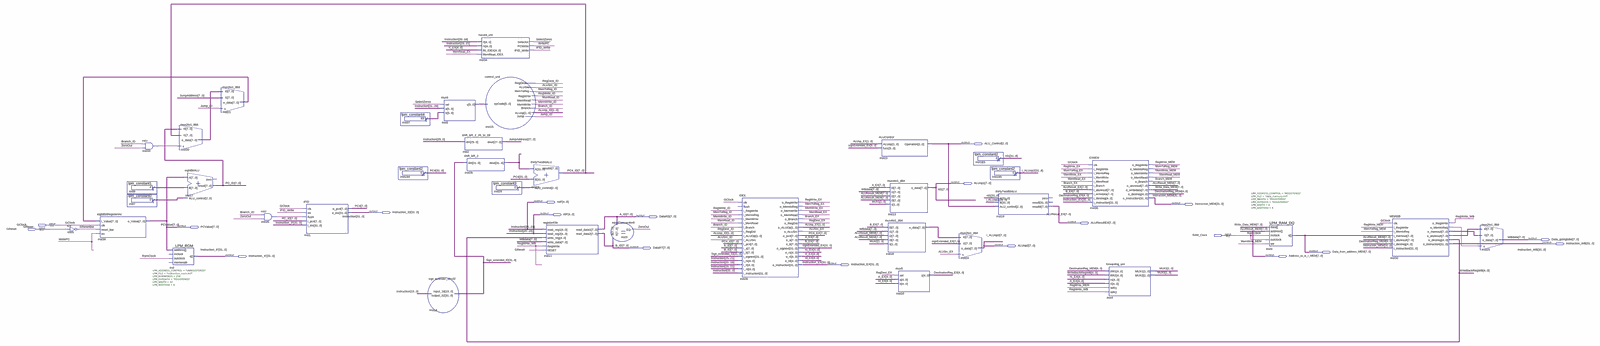
[diagram p0: schematic sheet, whole]
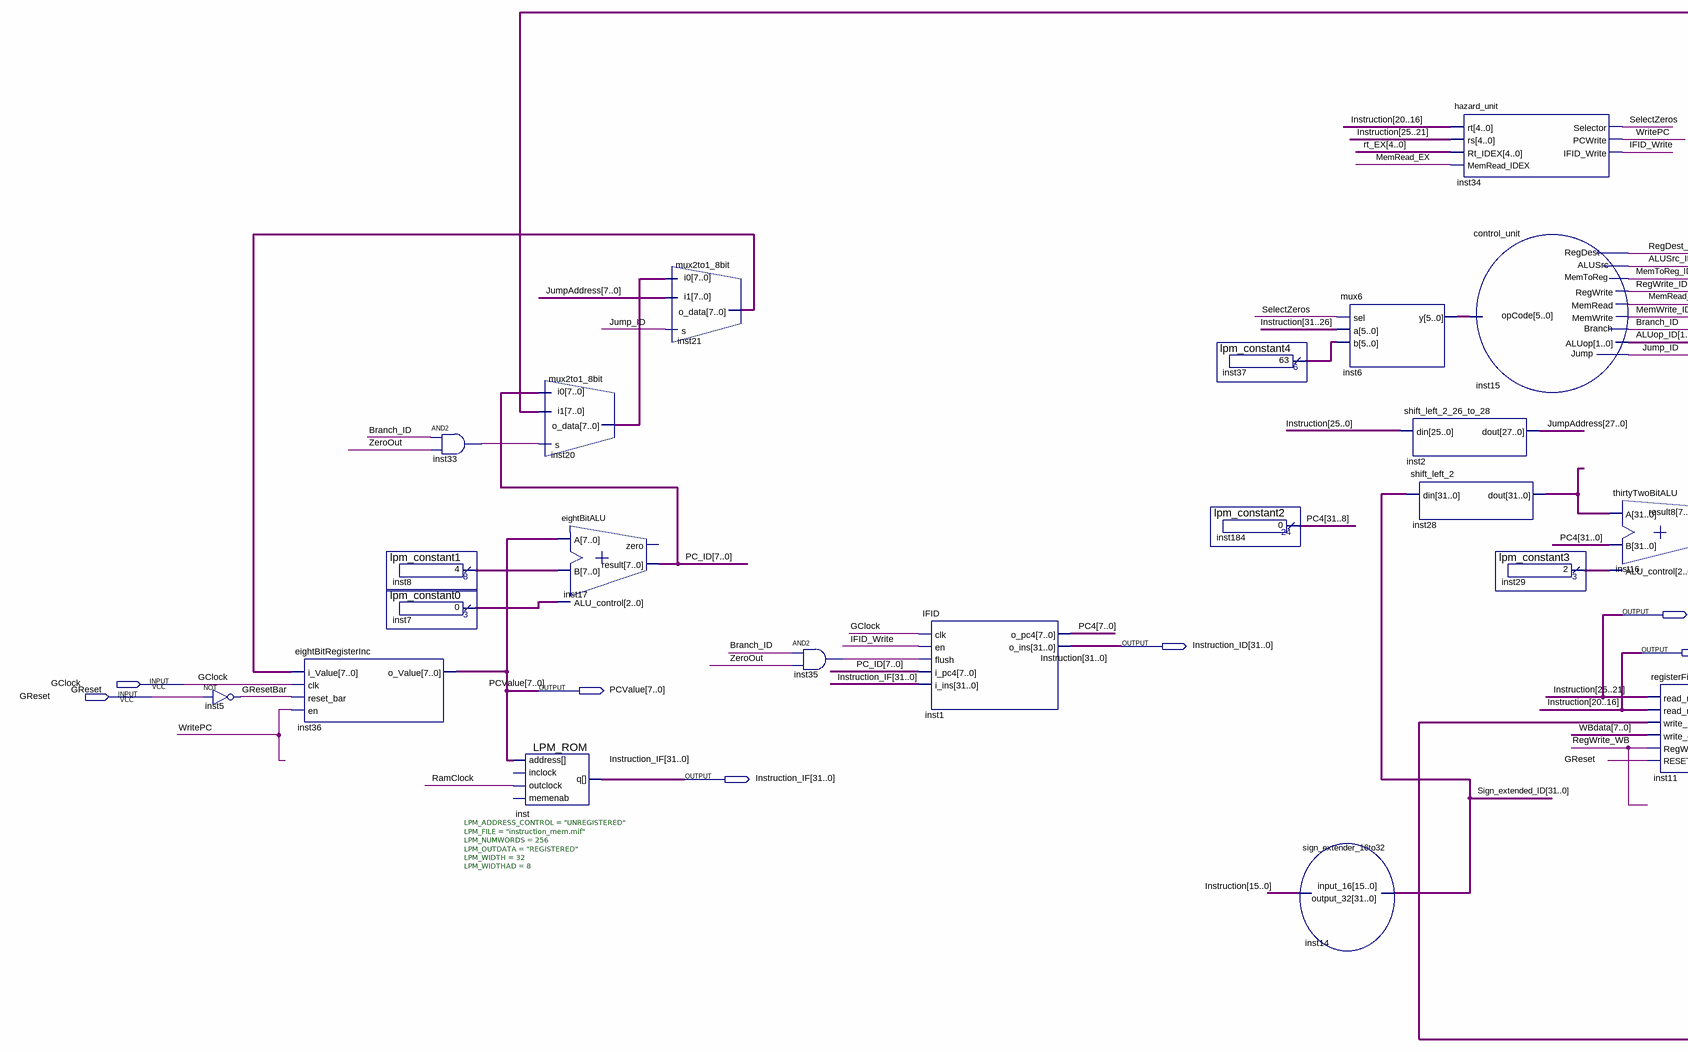
[diagram p1: schematic sheet, left part]
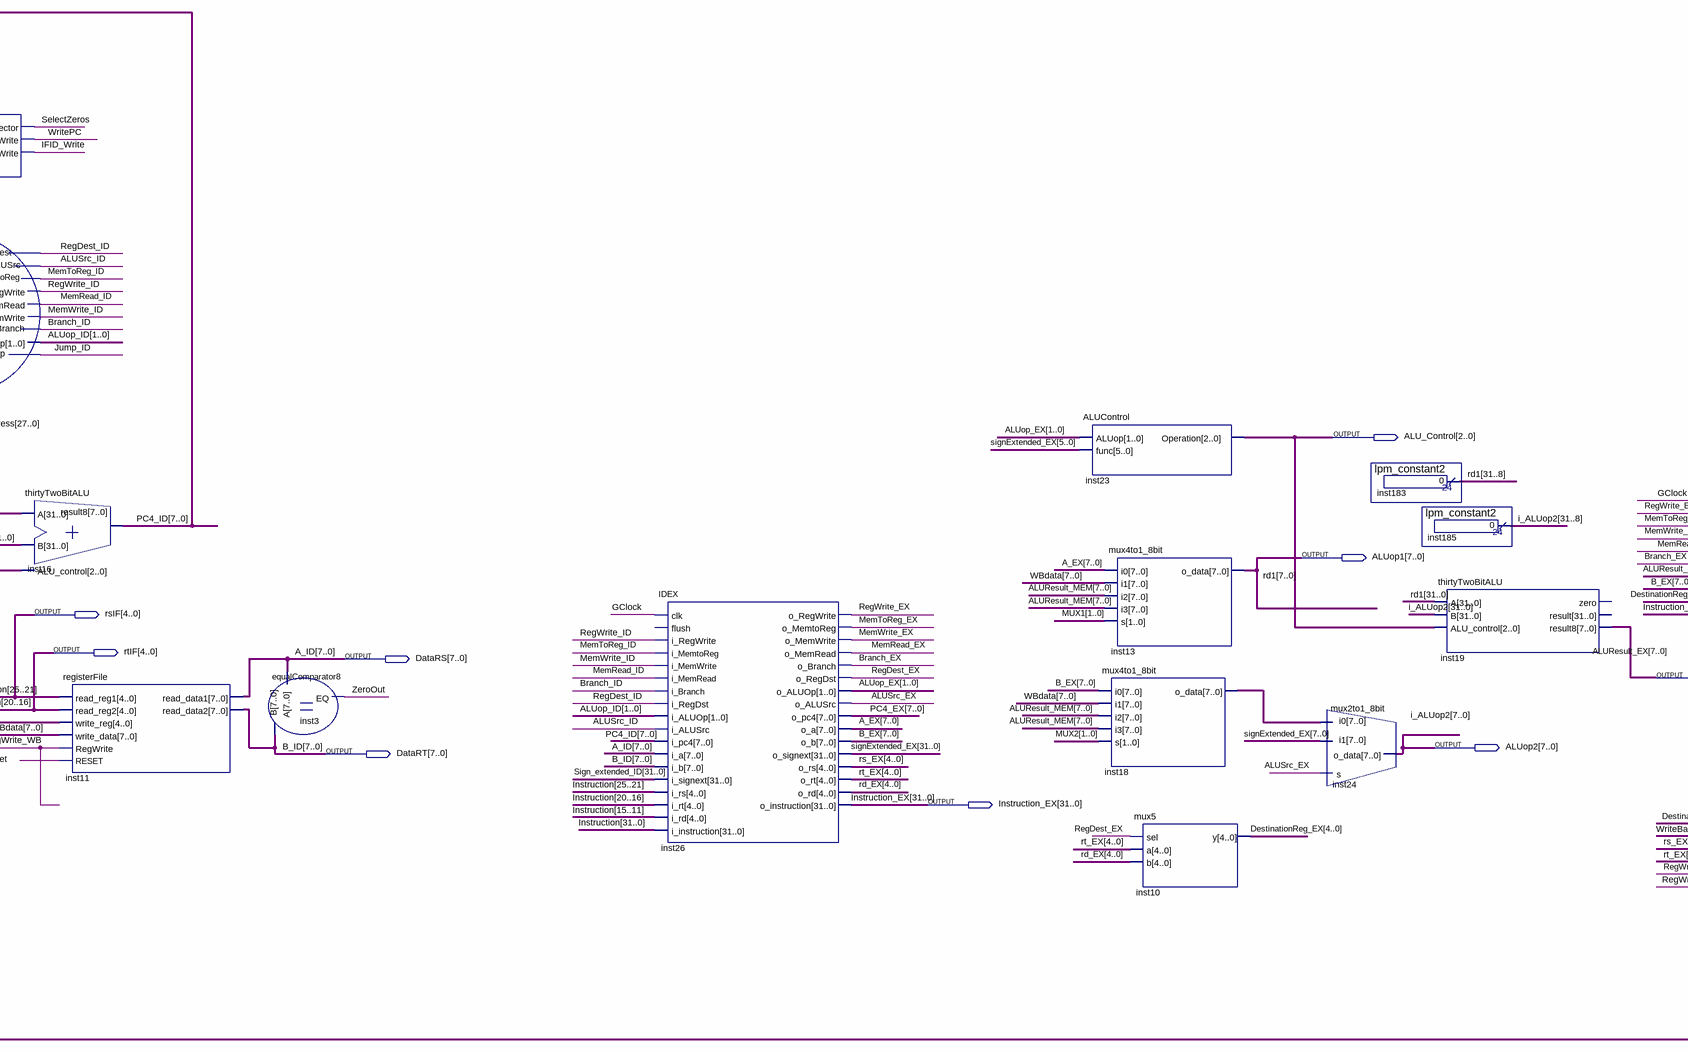
[diagram p2: schematic sheet, centre part]
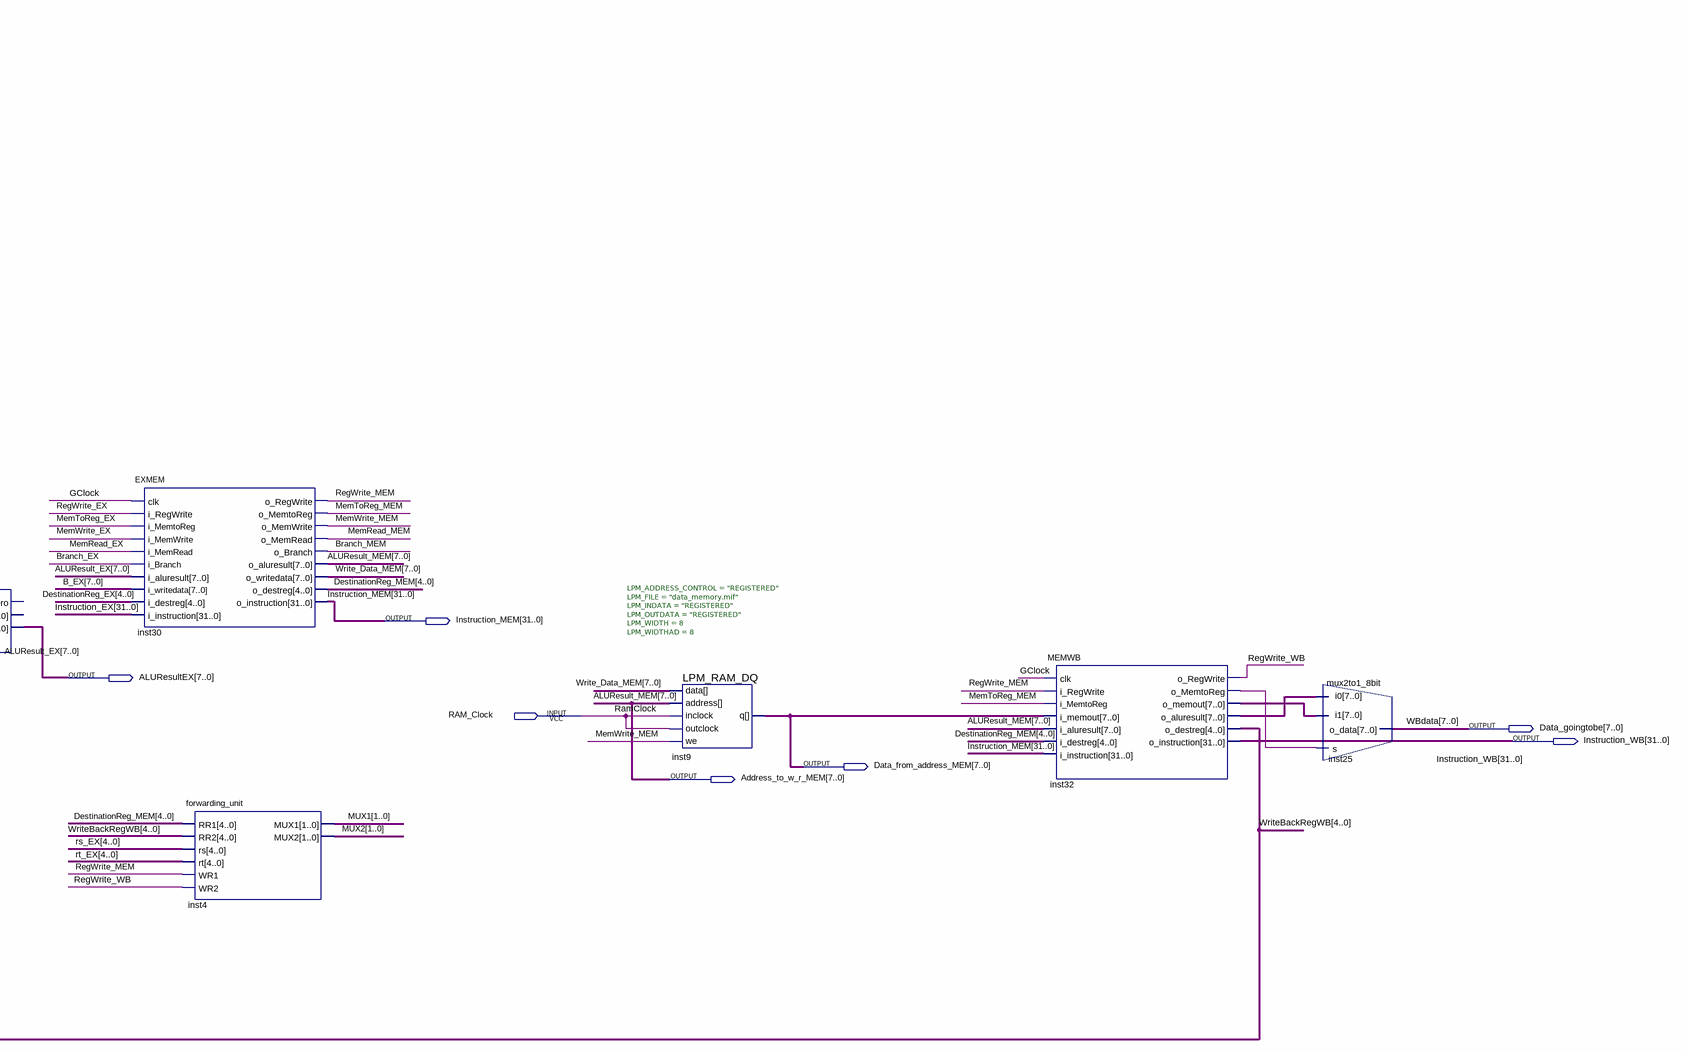
[diagram p3: schematic sheet, right part]
// Quartus schematic Lab3.bdf as structural Verilog: 37 symbols, 20 pins
module Lab3 (
  input  GClock,
  input  GReset,
  input  RAM_Clock,
  output [2:0] ALU_Control,
  output [7:0] ALUop1,
  output [4:0] rsIF,
  output [31:0] Instruction_MEM,
  output [31:0] Instruction_ID,
  output [4:0] rtIF,
  output [7:0] DataRS,
  output [7:0] ALUResultEX,
  output [7:0] PCValue,
  output [7:0] Data_goingtobe,
  output [31:0] Instruction_WB,
  output [7:0] ALUop2,
  output [7:0] DataRT,
  output [7:0] Data_from_address_MEM,
  output [31:0] Instruction_IF,
  output [7:0] Address_to_w_r_MEM,
  output [31:0] Instruction_EX
);

  wire ALUSrc_EX, ALUSrc_ID, Branch_EX, Branch_ID, Branch_MEM, GResetBar, IFID_Write, inst32_o_memtoreg,
       inst33_out, inst35_out, Jump_ID, MemRead_EX, MemRead_ID, MemRead_MEM, MemToReg_EX, MemToReg_ID,
       MemToReg_MEM, MemWrite_EX, MemWrite_ID, MemWrite_MEM, RegDest_EX, RegDest_ID, RegWrite_EX,
       RegWrite_ID, RegWrite_MEM, RegWrite_WB, SelectZeros, WritePC, ZeroOut;
  wire [1:0] ALUop_EX, ALUop_ID, MUX1, MUX2;
  wire [2:0] inst7_result, inst29_result;
  wire [4:0] DestinationReg_EX, DestinationReg_MEM, rd_EX, rs_EX, rt_EX, WriteBackRegWB;
  wire [5:0] inst6_y, inst37_result;
  wire [7:0] A_EX, B_EX, inst8_result, inst18_o_data, inst20_o_data, inst21_o_data, inst32_o_aluresult,
       inst32_o_memout, PC4_EX, PC4_ID, PC_ID, Write_Data_MEM;
  wire [27:0] JumpAddress;
  wire [31:0] inst28_dout, PC4, Sign_extended_ID, signExtended_EX;
  wire [31:8] i_ALUop2, rd1;

  not inst5 (GResetBar, GReset);
  eightBitRegisterInc inst36 (
    .i_Value(inst21_o_data), .clk(GClock), .reset_bar(GResetBar), .en(WritePC), .o_Value(PCValue));
  lpm_constant1 inst8 (.result(inst8_result));
  lpm_constant0 inst7 (.result(inst7_result));
  and inst33 (inst33_out, Branch_ID, ZeroOut);
  LPM_ROM #(.LPM_ADDRESS_CONTROL("UNREGISTERED"), .LPM_FILE("instruction_mem.mif"), .LPM_NUMWORDS(256), .LPM_OUTDATA("REGISTERED"), .LPM_WIDTH(32), .LPM_WIDTHAD(8)) inst (
    .address(PCValue), .outclock(RAM_Clock), .q(Instruction_IF));  // open: inclock, memenab
  mux2to1_8bit inst20 (.i0(PC_ID), .i1(PC4_ID), .s(inst33_out), .o_data(inst20_o_data));
  eightBitALU inst17 (.A(PCValue), .B(inst8_result), .ALU_control(inst7_result), .result(PC_ID));  // open: zero
  mux2to1_8bit inst21 (.i0(inst20_o_data), .i1(JumpAddress[7:0]), .s(Jump_ID), .o_data(inst21_o_data));
  and inst35 (inst35_out, Branch_ID, ZeroOut);
  IFID inst1 (
    .clk(GClock), .en(IFID_Write), .flush(inst35_out), .i_pc4(PC_ID), .i_ins(Instruction_IF),
    .o_pc4(PC4[7:0]), .o_ins(Instruction_ID));
  lpm_constant4 inst37 (.result(inst37_result));
  lpm_constant2 inst184 (.result(PC4[31:8]));
  mux6 inst6 (.sel(SelectZeros), .a(Instruction_ID[31:26]), .b(inst37_result), .y(inst6_y));
  sign_extender_16to32 inst14 (.input_16(Instruction_ID[15:0]), .output_32(Sign_extended_ID));
  shift_left_2_26_to_28 inst2 (.din(Instruction_ID[25:0]), .dout(JumpAddress));
  shift_left_2 inst28 (.din(Sign_extended_ID), .dout(inst28_dout));
  hazard_unit inst34 (
    .rt(Instruction_ID[20:16]), .rs(Instruction_ID[25:21]), .Rt_IDEX(rt_EX), .MemRead_IDEX(MemRead_EX),
    .Selector(SelectZeros), .PCWrite(WritePC), .IFID_Write(IFID_Write));
  control_unit inst15 (
    .opCode(inst6_y), .RegDest(RegDest_ID), .ALUSrc(ALUSrc_ID), .MemToReg(MemToReg_ID),
    .RegWrite(RegWrite_ID), .MemRead(MemRead_ID), .MemWrite(MemWrite_ID), .Branch(Branch_ID),
    .ALUop(ALUop_ID), .Jump(Jump_ID));
  lpm_constant3 inst29 (.result(inst29_result));
  thirtyTwoBitALU inst16 (.A(inst28_dout), .B(PC4), .ALU_control(inst29_result), .result8(PC4_ID));
  registerFile inst11 (
    .read_reg1(Instruction_ID[25:21]), .read_reg2(Instruction_ID[20:16]), .write_reg(WriteBackRegWB),
    .write_data(Data_goingtobe), .RegWrite(RegWrite_WB), .RESET(GReset), .read_data1(DataRS),
    .read_data2(DataRT));
  equalComparator8 inst3 (.A(DataRS), .B(DataRT), .EQ(ZeroOut));
  IDEX inst26 (
    .clk(GClock), .i_RegWrite(RegWrite_ID), .i_MemtoReg(MemToReg_ID), .i_MemWrite(MemWrite_ID),
    .i_MemRead(MemRead_ID), .i_Branch(Branch_ID), .i_RegDst(RegDest_ID), .i_ALUOp(ALUop_ID),
    .i_ALUSrc(ALUSrc_ID), .i_pc4(PC4_ID), .i_a(DataRS), .i_b(DataRT), .i_signext(Sign_extended_ID),
    .i_rs(Instruction_ID[25:21]), .i_rt(Instruction_ID[20:16]), .i_rd(Instruction_ID[15:11]),
    .i_instruction(Instruction_ID), .o_RegWrite(RegWrite_EX), .o_MemtoReg(MemToReg_EX),
    .o_MemWrite(MemWrite_EX), .o_MemRead(MemRead_EX), .o_Branch(Branch_EX), .o_RegDst(RegDest_EX),
    .o_ALUOp(ALUop_EX), .o_ALUSrc(ALUSrc_EX), .o_pc4(PC4_EX), .o_a(A_EX), .o_b(B_EX),
    .o_signext(signExtended_EX), .o_rs(rs_EX), .o_rt(rt_EX), .o_rd(rd_EX), .o_instruction(Instruction_EX));  // open: flush
  ALUControl inst23 (.ALUop(ALUop_EX), .func(signExtended_EX[5:0]), .Operation(ALU_Control));
  mux4to1_8bit inst13 (
    .i0(A_EX), .i1(Data_goingtobe), .i2(Address_to_w_r_MEM), .i3(Address_to_w_r_MEM), .s(MUX1),
    .o_data(ALUop1));
  mux4to1_8bit inst18 (
    .i0(B_EX), .i1(Data_goingtobe), .i2(Address_to_w_r_MEM), .i3(Address_to_w_r_MEM), .s(MUX2),
    .o_data(inst18_o_data));
  mux5 inst10 (.sel(RegDest_EX), .a(rt_EX), .b(rd_EX), .y(DestinationReg_EX));
  mux2to1_8bit inst24 (.i0(inst18_o_data), .i1(signExtended_EX[7:0]), .s(ALUSrc_EX), .o_data(ALUop2));
  lpm_constant2 inst183 (.result(rd1));
  lpm_constant2 inst185 (.result(i_ALUop2));
  thirtyTwoBitALU inst19 (
    .A({rd1, ALUop1}), .B({i_ALUop2, ALUop2}), .ALU_control(ALU_Control), .result8(ALUResultEX));  // open: zero, result
  EXMEM inst30 (
    .clk(GClock), .i_RegWrite(RegWrite_EX), .i_MemtoReg(MemToReg_EX), .i_MemWrite(MemWrite_EX),
    .i_MemRead(MemRead_EX), .i_Branch(Branch_EX), .i_aluresult(ALUResultEX), .i_writedata(B_EX),
    .i_destreg(DestinationReg_EX), .i_instruction(Instruction_EX), .o_RegWrite(RegWrite_MEM),
    .o_MemtoReg(MemToReg_MEM), .o_MemWrite(MemWrite_MEM), .o_MemRead(MemRead_MEM), .o_Branch(Branch_MEM),
    .o_aluresult(Address_to_w_r_MEM), .o_writedata(Write_Data_MEM), .o_destreg(DestinationReg_MEM),
    .o_instruction(Instruction_MEM));
  forwarding_unit inst4 (
    .RR1(DestinationReg_MEM), .RR2(WriteBackRegWB), .rs(rs_EX), .rt(rt_EX), .WR1(RegWrite_MEM),
    .WR2(RegWrite_WB), .MUX1(MUX1), .MUX2(MUX2));
  LPM_RAM_DQ #(.LPM_ADDRESS_CONTROL("REGISTERED"), .LPM_FILE("data_memory.mif"), .LPM_INDATA("REGISTERED"), .LPM_OUTDATA("REGISTERED"), .LPM_WIDTH(8), .LPM_WIDTHAD(8)) inst9 (
    .inclock(RAM_Clock), .data(Write_Data_MEM), .address(Address_to_w_r_MEM), .we(MemWrite_MEM),
    .outclock(RAM_Clock), .q(Data_from_address_MEM));
  MEMWB inst32 (
    .clk(GClock), .i_RegWrite(RegWrite_MEM), .i_MemtoReg(MemToReg_MEM), .i_memout(Data_from_address_MEM),
    .i_aluresult(Address_to_w_r_MEM), .i_destreg(DestinationReg_MEM), .i_instruction(Instruction_MEM),
    .o_RegWrite(RegWrite_WB), .o_MemtoReg(inst32_o_memtoreg), .o_memout(inst32_o_memout),
    .o_aluresult(inst32_o_aluresult), .o_destreg(WriteBackRegWB), .o_instruction(Instruction_WB));
  mux2to1_8bit inst25 (.i0(inst32_o_aluresult), .i1(inst32_o_memout), .s(inst32_o_memtoreg), .o_data(Data_goingtobe));

  assign rsIF = Instruction_ID[25:21];
  assign rtIF = Instruction_ID[20:16];

  // Other names for the same wires on the sheet: A_ID[7:0] = DataRS; ALUResult_MEM[7:0] = Address_to_w_r_MEM;
  //   i_ALUop2[7:0] = ALUop2; ALUResult_EX[7:0] = ALUResultEX; B_ID[7:0] = DataRT; Instruction[31:0] = Instruction_ID;
  //   RamClock = RAM_Clock; rd1[7:0] = ALUop1; WBdata[7:0] = Data_goingtobe
endmodule
